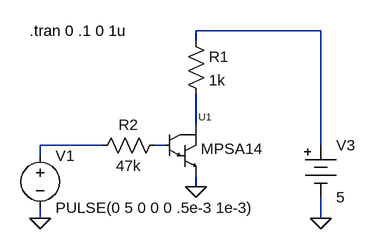
[diagram p0: schematic MPSA14_test1.asc]
MPSA14_test1.asc, the LTspice schematic file:
Version 4
SHEET 1 880 680
WIRE 416 0 224 0
WIRE 224 16 224 0
WIRE 224 144 224 96
WIRE 80 176 -16 176
WIRE 176 176 160 176
WIRE 416 176 416 0
WIRE -16 192 -16 176
WIRE 224 240 224 224
WIRE -16 288 -16 272
WIRE 416 288 416 256
FLAG -16 288 0
FLAG 224 240 0
FLAG 416 288 0
SYMBOL voltage -16 176 R0
WINDOW 123 0 0 Left 0
WINDOW 39 0 0 Left 0
SYMATTR InstName V1
SYMATTR Value PULSE(0 5 0 0 0 .5e-3 1e-3)
SYMBOL res 208 0 R0
SYMATTR InstName R1
SYMATTR Value 1k
SYMBOL res 176 160 R90
WINDOW 0 0 56 VBottom 0
WINDOW 3 32 56 VTop 0
SYMATTR InstName R2
SYMATTR Value 47k
SYMBOL Misc\\battery 416 160 R0
WINDOW 123 0 0 Left 0
WINDOW 39 0 0 Left 0
SYMATTR InstName V3
SYMATTR Value 5
SYMBOL MPSA14 208 192 R0
SYMATTR InstName U1
TEXT -32 0 Left 0 !.tran 0 .1 0 1u

The netlist it stands for:
* MPSA14_test1.asc
V1 N003 0 PULSE(0 5 0 0 0 .5e-3 1e-3)
R1 N001 N002 1k
R2 N004 N003 47k
V3 N001 0 5
XU1 N002 N004 0 MPSA92  ; pins C B E
.tran 0 .1 0 1u
.lib MPSA14.lib
.backanno
.end